# EAGLE design HumTx (EAGLE 9.2.2)
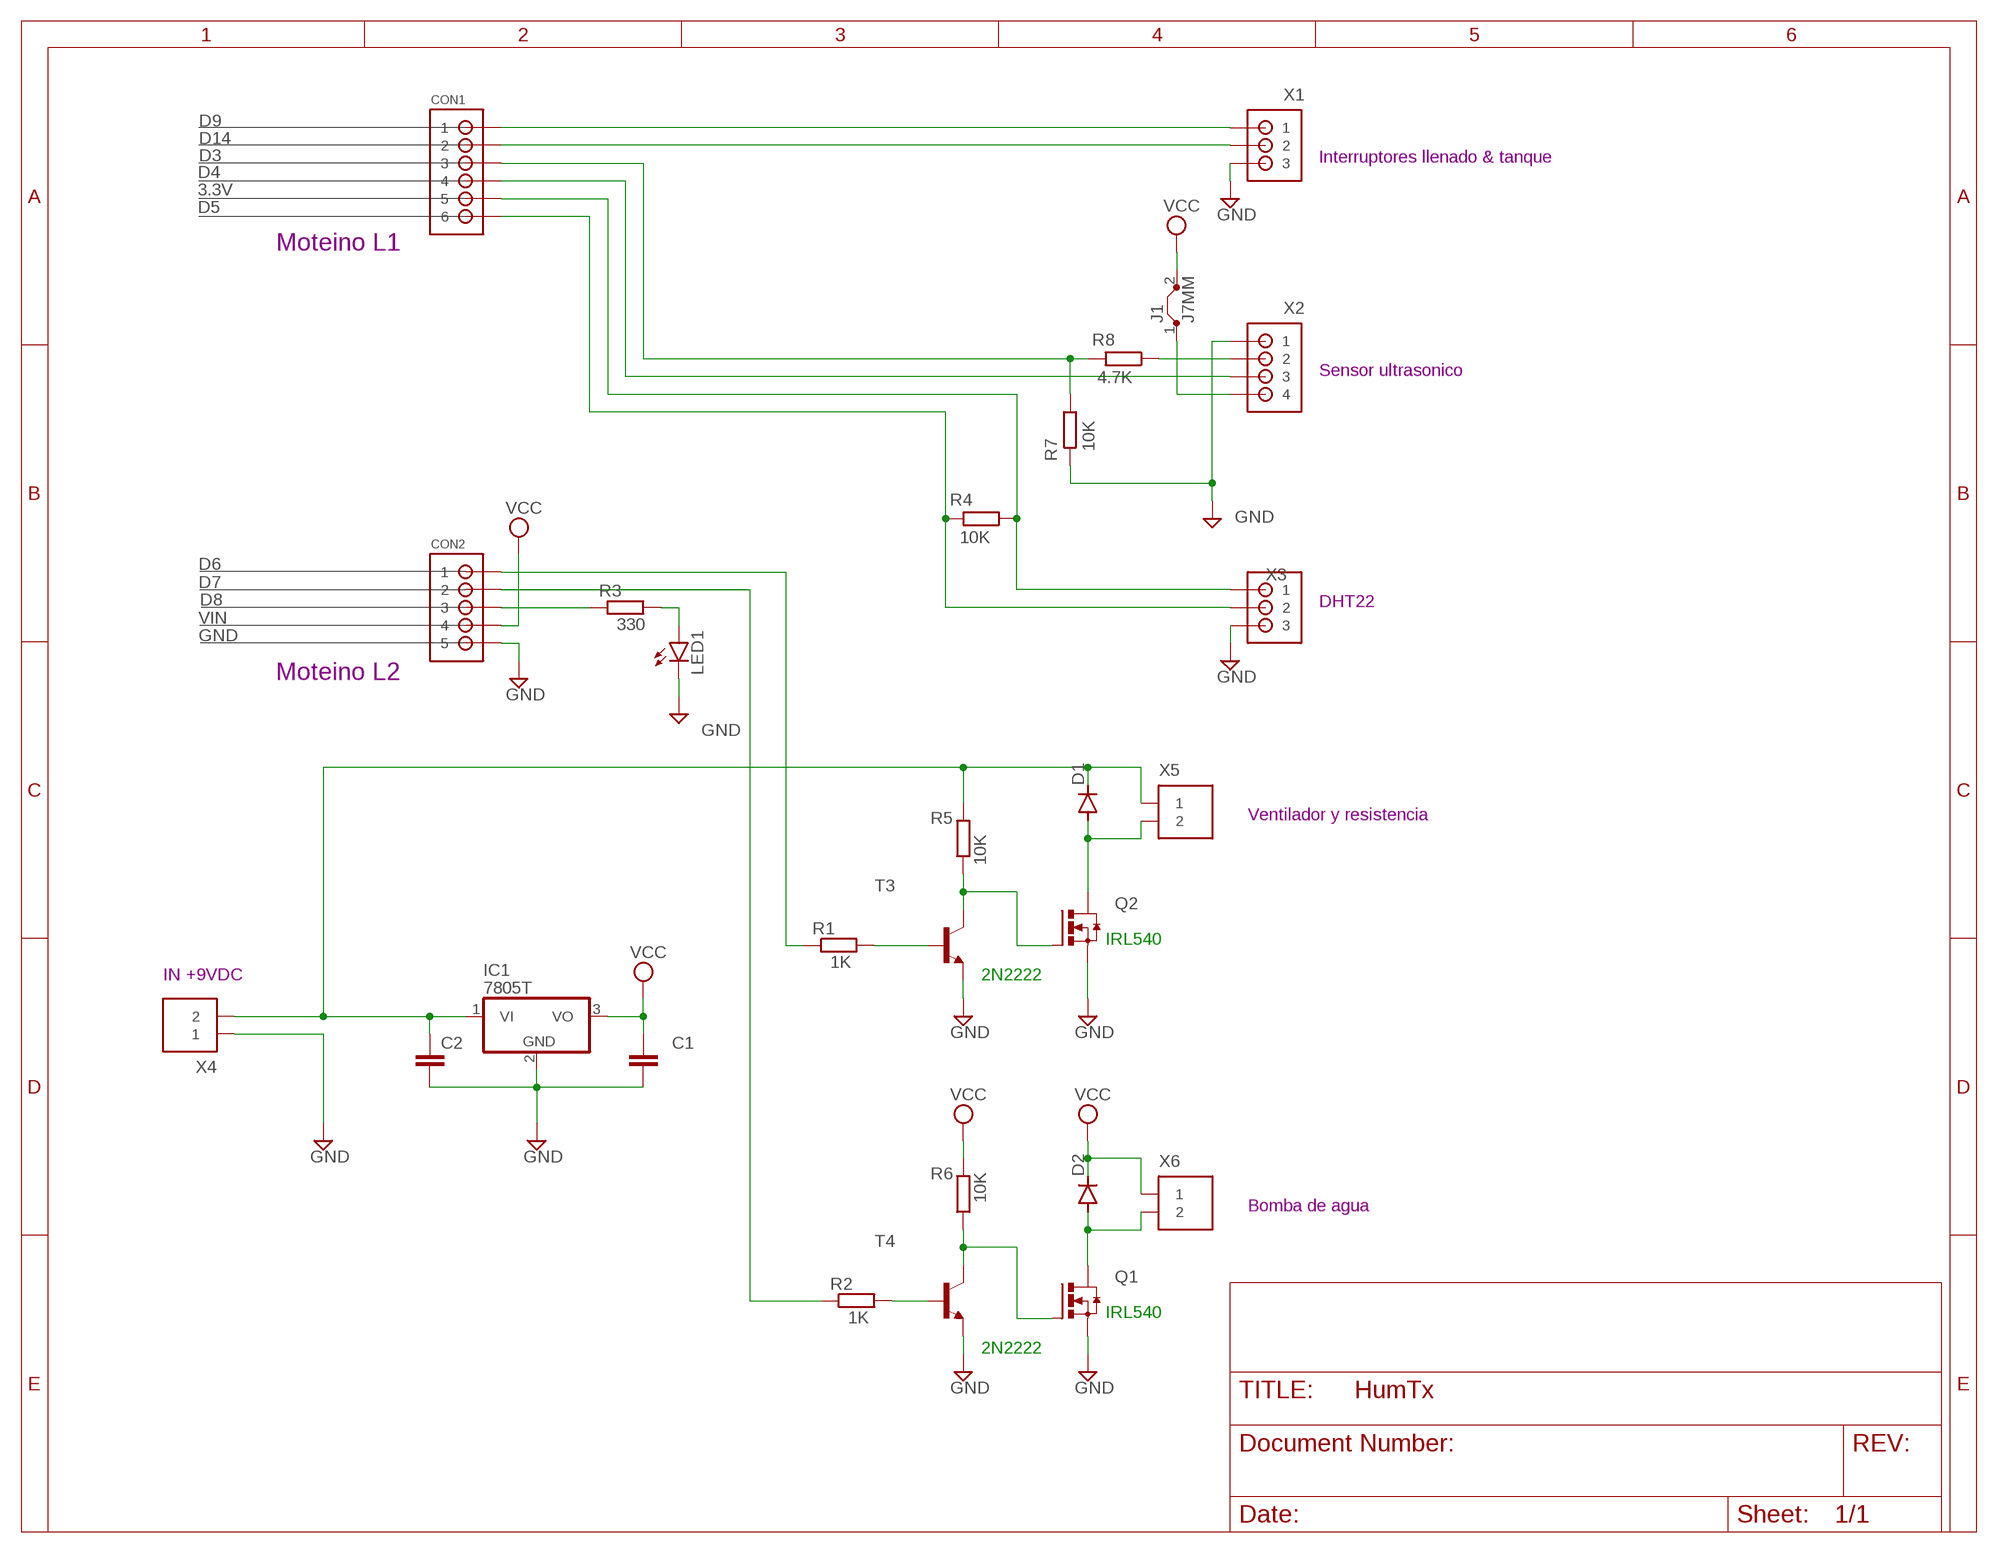
[diagram p0: schematic, sheet 1]

## Parts
C1  C5/7.2  [C5B7.2]
C2  C5/7.2  [C5B7.2]
CON1  B6B-ZR  [B6B-ZR]
CON2  B5B-ZR  [B5B-ZR]
D1  1N4004  [DO41-10]
D2  1N4004  [DO41-10]
IC1  7805T  [TO220H]
J1  J7MM  [07]
LED1  LED5MM  [LED5MM]
Q1  IRF3704-H  [TO220BH]
Q2  IRF3704-H  [TO220BH]
R1  1K  R0207/10  [0207/10]
R2  1K  R0207/10  [0207/10]
R3  330  R0207/10  [0207/10]
R4  10K  R0207/10  [0207/10]
R5  10K  R0204/7  [0204/7]
R6  10K  R0204/7  [0204/7]
R7  10K  R0207/10  [0207/10]
R8  4.7K  R0207/10  [0207/10]
T3  -NPN-TO92-EBC  [TO92-EBC]
T4  -NPN-TO92-EBC  [TO92-EBC]
X1  B3B-ZR  [B3B-ZR]
X2  B4B-ZR  [B4B-ZR]
X3  B3B-ZR  [B3B-ZR]
X4  MKS1852-6-0-202  [MKS1852-6-0-202]
X5  MKS1852-6-0-202  [MKS1852-6-0-202]
X6  MKS1852-6-0-202  [MKS1852-6-0-202]

## Nets
GND: C1.2 C2.2 CON2.5 IC1.2(GND) LED1.K(C) Q1.S Q2.S R7.2 T3.E T4.E X1.3 X2.1 X3.3 X4.1
N$1: R2.2 T4.B
N$2: R1.2 T3.B
N$3: Q2.G R5.1 T3.C
N$4: LED1.A R3.2
N$5: D1.A Q2.D X5.2
N$6: D2.A Q1.D X6.2
N$7: CON1.5 R4.1 X3.1
N$8: CON1.1 X1.1
N$9: CON1.2 X1.2
N$10: CON1.6 R4.2 X3.2
N$11: CON1.4 X2.3
N$12: CON1.3 R7.1 R8.2
N$13: CON2.3 R3.1
N$14: CON2.1 R1.1
N$15: CON2.2 R2.1
N$16: C2.1 D1.C IC1.1(VI) R5.2 X4.2 X5.1
N$17: Q1.G R6.1 T4.C
N$18: R8.1 X2.2
N$19: J1.1 X2.4
VCC: C1.1 CON2.4 D2.C IC1.3(VO) J1.2 R6.2 X6.1

## Notes on the sheet
- D9
- D14 | Interruptores llenado & tanque
- D4 | D3
- 3.3V
- D5
- Moteino L1
- Sensor ultrasonico
- D6
- D7
- D8 | DHT22
- VIN
- GND
- Moteino L2
- Ventilador y resistencia
- IRL540
- IN +9VDC | 2N2222
- Bomba de agua
- IRL540
- 2N2222

## Library data of the parts
C1 C2 = capacitor-wima_mod:C: CAPACITOR naming: grid - package width
CON1 = jst:B6B-ZR: JST-ZH Connector 6 pol, 1.5mm pitch Package: B6B-ZR Source: http://www.jst-mfg.com/product/pdf/eng/eZH.pdf
CON2 = jstmod:B5B-ZR: JST-ZH Connector 5 pol, 1.5mm pitch Package: B5B-ZR Source: http://www.jst-mfg.com/product/pdf/eng/eZH.pdf
D1 D2 = diode_mod:1N4004: DIODE general purpose rectifier, 1 A
IC1 = linear:78*: Positive VOLTAGE REGULATOR Source: http://cache.national.com/ds/LM/LM78L05.pdf http://www.fairchildsemi.com/ds/LM/LM7805.pdf
J1 = jumper:J: Bridge
LED1 = ledmod:LED: LED OSRAM: - CHIPLED LG R971, LG N971, LY N971, LG Q971, LY Q971, LO R971, LY R971 LH N974, LH R974 LS Q976, LO Q976, LY Q976 LO Q996 - Hyper CHIPLED LW Q18S LB Q993, LB Q99A, LB R99A - SideLED LS A670, LO A670, LY A670, LG A670, LP A670 LB A673, LV A673, LT A673, LW A673 LH A674 LY A675 LS A676, LA A676, LO A676, LY A676, LW A676 LS A679, LY A679, LG A679 - Hyper Micro SIDELED® LS Y876, LA Y876, LO Y876, LY Y876 LT Y87S - SmartLED LW L88C, LW L88S LB L89C, LB L89S, LG L890 LS L89K, LO L89K, LY L89K LS L896, LA L896, LO L896, LY L896 - TOPLED LS T670, LO T670, LY T670, LG T670, LP T670 LSG T670, LSP T670, LSY T670, LOP T670, LYG T670 LG T671, LOG T671, LSG T671 LB T673, LV T673, LT T673, LW T673 LH T674 LS T676, LA T676, LO T676, LY T676, LB T676, LH T676, LSB T676, LW T676 LB T67C, LV T67C, LT T67C, LS T67K, LO T67K, LY T67K, LW E67C LS E67B, LA E67B, LO E67B, LY E67B, LB E67C, LV E67C, LT E67C LW T67C LS T679, LY T679, LG T679 LS T770, LO T770, LY T770, LG T770, LP T770 LB T773, LV T773, LT T773, LW T773 LH T774 LS E675, LA E675, LY E675, LS T675 LS T776, LA T776, LO T776, LY T776, LB T776 LHGB T686 LT T68C, LB T68C - Hyper Mini TOPLED® LB M676 - Mini TOPLED Santana® LG M470 LS M47K, LO M47K, LY M47K Source: http://www.osram.convergy.de LUXEON: - LUMILED® LXK2-PW12-R00, LXK2-PW12-S00, LXK2-PW14-U00, LXK2-PW14-V00 LXK2-PM12-R00, LXK2-PM12-S00, LXK2-PM14-U00 LXK2-PE12-Q00, LXK2-PE12-R00, LXK2-PE12-S00, LXK2-PE14-T00, LXK2-PE14-U00 LXK2-PB12-K00, LXK2-PB12-L00, LXK2-PB12-M00, LXK2-PB14-N00, LXK2-PB14-P00, LXK2-PB14-Q00 LXK2-PR12-L00, LXK2-PR12-M00, LXK2-PR14-Q00, LXK2-PR14-R00 LXK2-PD12-Q00, LXK2-PD12-R00, LXK2-PD12-S00 LXK2-PH12-R00, LXK2-PH12-S00 LXK2-PL12-P00, LXK2-PL12-Q00, LXK2-PL12-R00 Source: www.luxeon.com KINGBRIGHT: KA-3528ASYC Source: www.kingbright.com
Q1 Q2 = transistor-power:IRF3704: SMPS MOSFET HEXFET® Power MOSFET Source: http://www.irf.com/product-info/datasheets/data/irf3704.pdf
R1-R8 = eagle-ltspice_mod:R: RESISTOR, European symbol; SPICEMODEL: NONE; SPICEPREFIX: R
T3 T4 = transistor_mod:*-NPN-: NPN Transistror BF959 corrected 2008.03.06
X1 X3 = jstmod:B3B-ZR: JST-ZH Connector 3 pol, 1.5mm pitch Package: B3B-ZR Source: http://www.jst-mfg.com/product/pdf/eng/eZH.pdf
X2 = jstmod:B4B-ZR: JST-ZH Connector 4 pol, 1.5mm pitch Package: B4B-ZR Source: http://www.jst-mfg.com/product/pdf/eng/eZH.pdf
X4-X6 = con-stocko_mod:MKS1852-6-0-202: Serie MKS 1850 Lötstifte In-line, Raster 2.5 mm, Stiftwannen, stehend, mit Rastlasche Source: http://www.stocko.de/de/index.php?seite=ka_rfk2_mks1850.html&rubrik=Katalog+-+RFK+2 rfk_1850.pdf; OC_FARNELL: unknown; OC_NEWARK: unknown

## Board
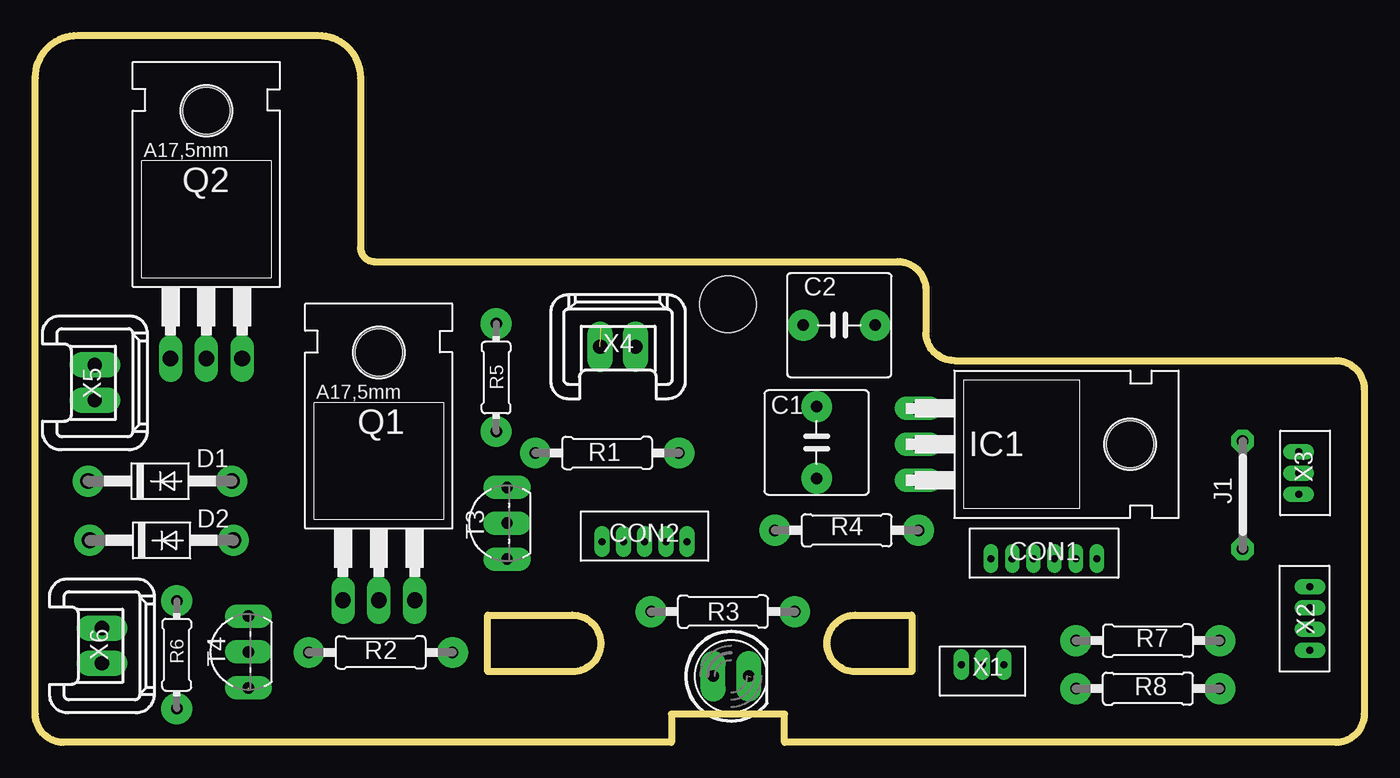
[diagram p1: board, top side]
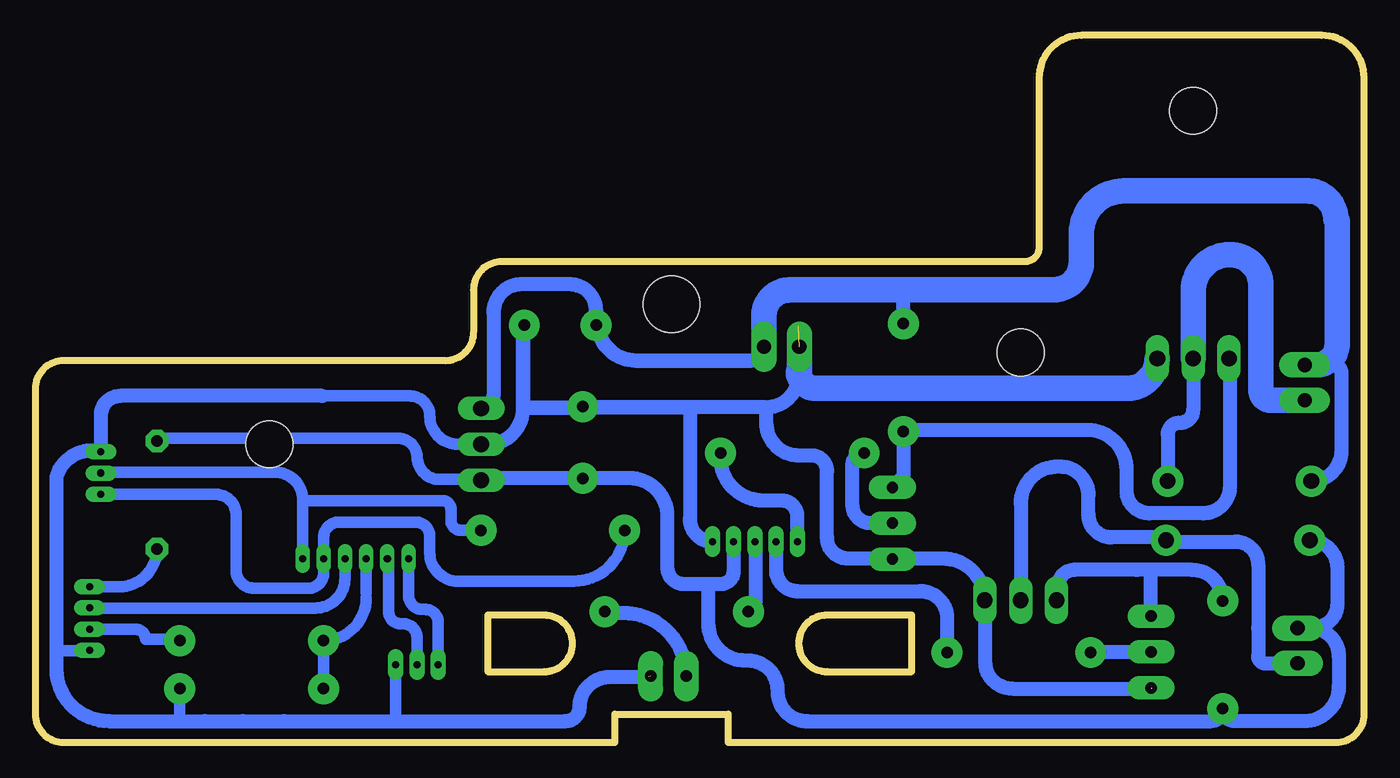
[diagram p2: board, bottom side, seen from below]

Size 94 x 50 mm. Coordinates in mm from the lower left corner, seen from the top.
Outline: 0,2 0,47 arc-90 3,50 20,50 arc-90 23,47 23,35 arc90 24,34 61,34 arc-90 63,32 63,29 arc90 65,27 92,27 arc-90 94,25 94,2 arc-90 92,0 53,0 53,2 45,2 45,0 2,0 arc-90 0,2
Outline: 38,5 32,5 32,9 38,9 arc-180 38,5
Outline: 58,9 62,9 62,5 58,5 arc-90 56,7 arc-90 58,9
Copper layers (1*16): Top 0.035mm / dielectric 1.5mm / Bottom 0.035mm
Design rules "default *": minimum track width 10mil, minimum drill 0.2mm, track to track 6mil, track to pad 6mil, pad to pad 6mil, via to via 6mil, smd to smd 6mil, copper to edge 20mil, drill to drill 6mil, minimum pad ring 10mil, minimum via ring 8mil, stop-mask expansion 4mil, vias tented up to drill 0mil, thermal gap 10mil
Holes 4 mm at 49,31

### Footprints (pad centres in the part's own frame; a part is rotated, then mirrored left to right if it is on the bottom)
C5B7.2 = drill 0.813 pad 2.184: 1 -2.54,0; 2 2.54,0
B6B-ZR = drill 0.5 pad 1 long: 1 9,-1.3; 2 7.5,-1.3; 3 6,-1.3; 4 4.5,-1.3; 5 3,-1.3; 6 1.5,-1.3
B5B-ZR = drill 0.5 pad 1.1 long: 1 7.5,-1.3; 2 6,-1.3; 3 4.5,-1.3; 4 3,-1.3; 5 1.5,-1.3
DO41-10 = drill 1.118 pad 2.184: A 5.08,0; C -5.08,0
TO220H = drill 1.118 long: 1 -2.54,-10.16; 2 0,-10.16; 3 2.54,-10.16 | hole 3.302: 0,4.826
07 = drill 0.813 pad 1.6 octagon: 1 -3.81,0; 2 3.81,0
LED5MM = drill 0.813 pad 1.778 long: A -1.27,0; K 1.27,0
TO220BH = drill 1.118 long: D 0,-6.35; G -2.54,-6.35; S 2.54,-6.35 | hole 3.302: 0,11.176
0207/10 = drill 0.813 pad 2.184: 1 -5.08,0; 2 5.08,0
0204/7 = drill 0.813 pad 2.184: 1 -3.81,0; 2 3.81,0
TO92-EBC = drill 0.813 pad 1.676 long: B 0,-1.27; C 2.54,-1.27; E -2.54,-1.27
B3B-ZR = drill 0.5 pad 1.1 long: 1 -1.5,0; 2 0,0; 3 1.5,0
B4B-ZR = drill 0.5 pad 1.1 long: 1 6,-1.3; 2 4.5,-1.3; 3 3,-1.3; 4 1.5,-1.3
MKS1852-6-0-202 = drill 1 pad 1.8 long: 1 -1.25,0; 2 1.25,0

### Placement (x,y rotation side)
C1  55.27,21.21 90 top
C2  56.87,29.51 0 top
CON1  76.6,11.7 180 top
CON2  47.6,12.9 180 top
D1  8.82,18.48 0 top
D2  8.93,14.29 0 top
IC1  72.62,21.08 270 top
J1  85.4,17.5 90 top
LED1  49.21,4.68 0 top
Q1  24.3,16.4 0 top
Q2  12.1,33.5 0 top
R1  40.45,20.47 180 top
R2  24.43,6.36 180 top
R3  48.64,9.25 0 top
R4  57.4,15 0 top
R5  32.6,25.8 90 top
R6  10,6.2 270 top
R7  78.7,3.8 0 top
R8  78.7,7.2 180 top
T3  32.1,15.5 90 top
T4  13.8,6.4 90 top
X1  67,5.5 0 top
X2  91.46,12.51 270 top
X3  89.37,19.05 90 top
X4  41.21,27.98 0 top
X5  4.21,25.44 270 top
X6  4.71,6.84 270 top

### Tracks (layer width: path | path; a pad name or v marks a point on that pad's centre or on a via)
GND  (3 unrouted)
  Bottom 0.152: 59.4,29.48 C2.2 | C1.2 55.75,23.27
  Bottom 0.254: 62.74,20.8 arc-90 IC1.2 arc-90 62.58,21.2 | 35.58,25.1 arc90 35.53,25.05 | 40,29.44 arc90 39.96,29.48 | 26.8,10.01 arc-90 Q1.S | 59.5,23.6 59.5,23.66 arc90 59.48,23.68 | 83.76,1.54 arc90 83.8,1.5 arc-90 83.78,1.52 | 79.26,1.54 arc90 79.3,1.5 | 76.4,1.5 arc90 76.46,1.56 | 82,1.5 arc90 82.16,1.66 | X2.1 arc90 X2.1 | 68.4,1.5 arc90 68.5,1.6 | 40,26 arc-90 39.96,26.04 | 33.33,13 arc-90 T3.E arc-90 33.41,13 33.5,13
  Bottom 0.61: IC1.2 arc90 62.74,20.8
  Bottom 0.8: IC1.2 64.08,21.08 arc90 66.1,23.1 arc-90 67.5,24.5 73.7,24.5 | X2.1 92.5,6.5 | 83.78,1.52 R7.2 | 68.5,1.6 X1.3
  Bottom 0.813: IC1.2 62.58,21.2
  Bottom 1: 73.7,24.5 88,24.5 arc-90 89.37,23.13 X3.3 arc-90 92.5,18.76 92.5,6.5 92.5,5.2 arc-90 88.8,1.5 83.8,1.5 82,1.5 79.3,1.5 76.4,1.5 68.4,1.5 56.5,1.5 arc-90 55.5,2.5 arc90 53.37,4.63 50.63,4.63 | Q1.S 26.84,11.14 | 47.7,23.7 47.7,15.8 arc-90 CON2.5 | Q1.S 26.8,10.09 | 42.3,23.7 arc-90 40,26 | 42.3,23.7 42.3,22.6 arc-90 40,20.3 39.1,20.3 arc90 38,19.2 38,14.5 arc-90 36.5,13 33.5,13 | 26.8,10.01 26.8,5.7 arc-90 24.9,3.8 15.07,3.8 | IC1.2 62.02,21.08 arc-90 59.5,23.6 | 42.3,23.7 47.5,23.7 | Q1.S arc-90 29.79,13 33.41,13
  Bottom 1.016: IC1.2 62.44,21.1 | C2.2 59.5,29.42 59.5,23.6 | 59.48,23.68 55.34,23.68 C1.2 55.22,23.7 47.7,23.7 47.5,23.7
  Bottom 1.8: Q2.S arc90 16.74,25.05 35.53,25.05 38.85,25.05 arc90 40,26.2 40,26 | 39.96,26.04 X4.1
N$1
  Bottom 0.254: R2.2 arc90 19.31,6.4
  Bottom 1: 19.31,6.4 T4.B
N$2
  Bottom 0.254: 35.3,20.41 arc-90 R1.2
  Bottom 1: T3.B 34.9,15.5 arc90 36.2,16.8 36.2,19.64 arc90 R1.2
N$3
  Bottom 0.254: Q2.G arc90 9.5,27.09
  Bottom 1: 9.5,27.09 9.5,18.1 arc90 11.4,16.2 15.2,16.2 arc90 16.8,17.8 16.8,19.3 arc-90 19.59,22.09 26.23,22.09 | 26.23,22.09 32.6,22.09 32.6,18.81 T3.C | 26.23,22.09 26.21,22.11
N$4
  Bottom 0.61: 48.04,4.78 LED1.A
  Bottom 1: LED1.A arc-90 52.41,9.15 53.72,9.15
N$5
  Bottom 0.254: 13,22.6 13.1,22.6
  Bottom 1: D1.A 13.9,21.8 arc90 13.1,22.6 | Q2.D 12.1,23.5 arc90 13,22.6
  Bottom 1.8: Q2.D 12.1,31.9 arc90 9.5,34.5 arc90 7.3,32.3 7.3,24.9 arc-90 6.59,24.19 X5.2
N$6
  Bottom 0.254: D2.A arc-90 13.92,14.2 arc90 D2.A | D2.A arc-90 14.22,14.5 | 21.5,19.5 21.7,19.5
  Bottom 1: 24.3,11 Q1.D 24.3,16.9 arc90 21.7,19.5 | 13.92,14.2 9.1,14.2 arc90 7.5,12.6 7.5,8.1 7.5,6.1 arc-90 6.99,5.59 X6.2 | 14.22,14.5 17.9,14.5 arc90 19.5,16.1 19.5,17.5 arc-90 21.5,19.5
N$7
  Bottom 0.8: R4.1 arc90 55.92,11.4 64.1,11.4 arc90 66.1,13.4 66.1,14.6 arc-90 67.07,15.57 72.53,15.57 arc-90 73.6,14.5 CON1.5 | X3.1 81.25,17.55 arc90 79.8,16.1 79.8,12.2 arc-90 78.5,10.9
  Bottom 0.813: CON1.5 73.6,12 arc90 74.7,10.9 78.5,10.9
N$8
  Bottom 0.254: 66.4,9.4 66.6,9.4
  Bottom 0.8: X1.1 65.5,8.5 arc-90 66.4,9.4 | 66.6,9.4 arc90 67.6,10.4 CON1.1
N$9
  Bottom 0.254: CON1.2 arc90 69,12.9 | 68.2,8.4 68,8.4
  Bottom 0.8: 69,12.9 69,9.2 arc-90 68.2,8.4 | 68,8.4 arc90 67,7.4 X1.2
N$10
  Bottom 0.254: X3.2 89.37,19.1
  Bottom 0.8: 75.1,17.1 75.1,17.2 arc-90 77,19.1 89.37,19.1 | 75.1,17.1 CON1.6 | 75.1,17.1 65.2,17.1 arc90 64.6,16.5 64.6,15.7 arc-90 63.9,15 R4.2
N$11
  Bottom 0.254: X2.3 arc-90 X2.3
  Bottom 0.8: 74.2,9.5 77.17,9.5 X2.3
  Bottom 0.813: 74.2,9.5 arc-90 72.1,11.6 CON1.4
N$12
  Bottom 0.254: 70.6,10.22 70.6,10.6
  Bottom 0.8: 70.6,10.22 arc90 R8.2 R7.1
  Bottom 0.813: 70.6,10.6 CON1.3
N$13
  Bottom 1: CON2.3 43.06,14.16 43.06,9.85 43.56,9.35
N$14
  Bottom 1: CON2.1 40.1,16 arc-90 41.2,17.1 42.5,17.1 arc90 45.53,20.13 R1.1
N$15
  Bottom 0.254: R2.1 arc90 R2.1
  Bottom 1: CON2.2 41.6,12.2 arc-90 40.1,10.7 31.4,10.7 arc90 29.5,8.8 R2.1
N$16
  Bottom 0.152: 54.25,29.75 C2.1
  Bottom 0.254: 32.6,31.5 33.1,32 | 2,37 arc90 1.9,36.9 | X5.1 3.41,26.69 2.19,26.69
  Bottom 1: D1.C arc-90 1.6,20.62 1.6,26.1 arc-90 2.19,26.69 | X4.2 arc90 43.44,27 | 32.6,29.51 32.6,31.5 | C2.1 54.33,30.53 arc-90 56.2,32.4 59.6,32.4 arc-90 61.6,30.4 61.6,24.48 arc90 IC1.1
  Bottom 1.016: 54.25,29.75 arc-90 51.5,27 43.44,27
  Bottom 1.8: X4.2 42.46,30.18 arc90 40.64,32 33.1,32 22,32 arc-90 20,34 20,36 arc90 17,39 4,39 arc90 2,37 | 1.9,36.9 1.9,28.2 arc90 3.41,26.69
N$17
  Bottom 0.254: T4.C arc90 15.1,8.97
  Bottom 1: Q1.G 21.65,10.16 21.65,11.05 arc90 20.5,12.2 16.1,12.2 15.1,12.2 | R6.1 arc-90 12.19,12.2 15.1,12.2 | 15.1,8.97 15.1,12.2
N$18
  Bottom 0.254: R8.1 arc-90 83.88,7.3
  Bottom 0.8: 83.88,7.3 86.2,7.3 arc-90 86.91,8.01 X2.2
N$19
  Bottom 0.8: X2.4 88.08,11.01 arc-90 J1.1
VCC
  Bottom 0.152: 55.8,18.67 C1.1
  Bottom 0.254: 3.61,8.09 X6.1 3.79,8.09 | CON2.4 arc-90 44.5,14.3 | 49.3,12.4 49.3,12.7 | 41.5,3.7 41.5,3.6 | C1.1 arc90 55.24,18.7 | 62.33,18.67 arc90 IC1.3 arc-90 62.52,18.6 | J1.2 85.3,21.41 | 72.7,21.5 arc90 72.71,21.51
  Bottom 0.8: 85.2,21.51 72.71,21.51 | 72.7,21.5 71.5,21.5 68.3,21.5 arc90 67,20.2 arc-90 65.4,18.6 64.5,18.6 62.52,18.6
  Bottom 1: D2.C arc90 1.9,12.34 1.9,9.8 arc90 3.61,8.09 | CON2.4 44.6,12.1 arc90 45.5,11.2 46.4,11.2 | 46.4,11.2 48.1,11.2 arc90 49.3,12.4 | 3.79,8.09 arc90 1.8,6.1 1.8,3.95 arc90 4.25,1.5 9.11,1.5 arc90 R6.2 arc90 10.89,1.5 39.4,1.5 arc90 41.5,3.6 | 46.4,11.2 46.4,8.4 arc-90 43.8,5.8 43.6,5.8 arc90 41.5,3.7 | 55.24,18.7 52,18.7 arc90 49.3,16 49.3,12.7 | C1.1 62.33,18.67 | J1.2 85.2,21.51
  Bottom 1.016: C1.1 55.2,18.6